# EasyEDA Pro project ProPrj_交通灯.epro

# Schematic Schematic2
Board Name: Board2; Create Date: 2024-10-21; Page Name: P1; Project Name: 交通灯-sell; Schematic Name: Schematic2; Update Date: 2024-10-21; Company: 嘉立创EDA; Page Size: A4; Version: V1.0
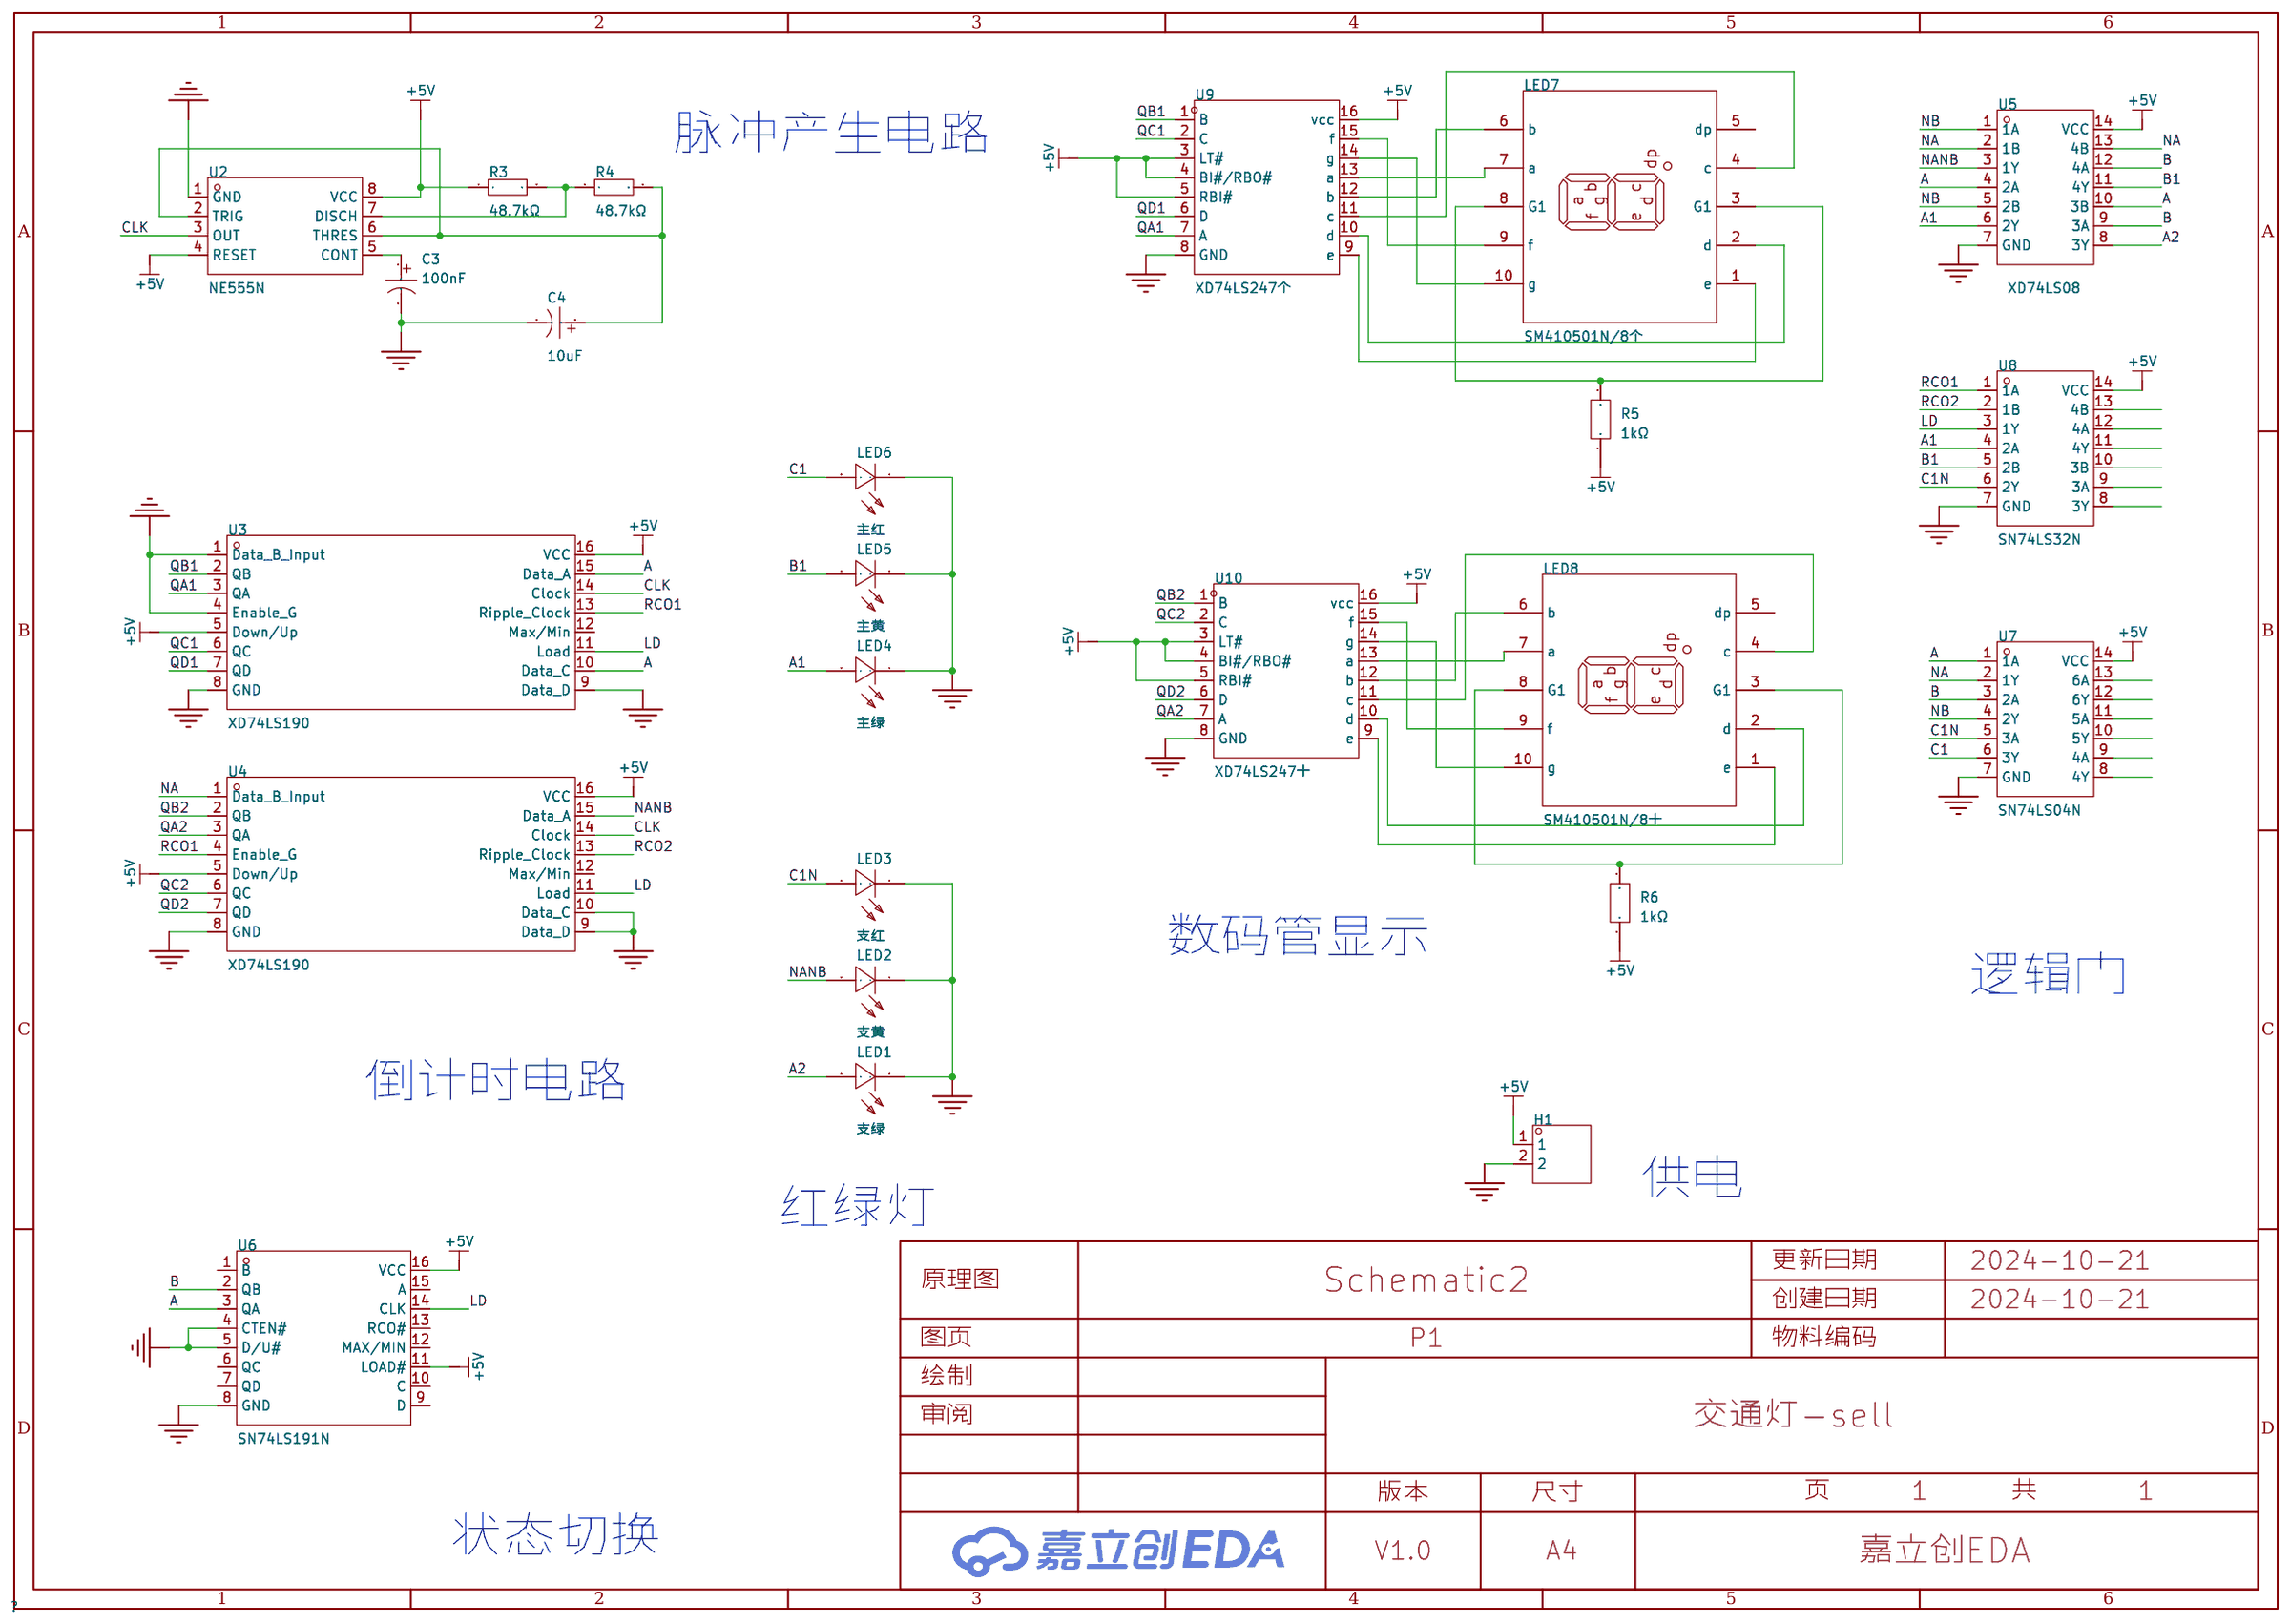
[diagram p0: schematic sheet]

## Parts
C3  100nF  [CAP-TH_BD4.0-P1.50-D0.8-FD]
C4  10uF  [CAP-TH_BD5.0-P2.00-D0.8-FD]
H1  -  [HDR-TH_2P-P2.54-V-M-1]
LED1  支绿  [LED-TH_BD3.9-P2.54-RD]
LED2  支黄  [LED-TH_BD3.9-P2.54-RD]
LED3  支红  [LED-TH_BD3.9-P2.54-RD]
LED4  主绿  [LED-TH_BD3.9-P2.54-RD]
LED5  主黄  [LED-TH_BD3.9-P2.54-RD]
LED6  主红  [LED-TH_BD3.9-P2.54-RD]
LED7  SM410501N/8个  [LED-SEG-TH_10P-L12.7-W19.0-P2.54-S15.24-BL]
LED8  SM410501N/8十  [LED-SEG-TH_10P-L12.7-W19.0-P2.54-S15.24-BL]
R3  48.7kΩ  [RES-TH_BD2.4-L6.3-P10.30-D0.6]
R4  48.7kΩ  [RES-TH_BD2.4-L6.3-P10.30-D0.6]
R5  1kΩ  [RES-TH_BD2.3-L6.5-P10.50-D0.5]
R6  1kΩ  [RES-TH_BD2.3-L6.5-P10.50-D0.5]
U2  NE555N  [DIP-8_L9.8-W6.6-P2.54-LS7.6-BL]
U3  XD74LS190  [DIP-16_L20.0-W6.4-P2.54-LS7.6-BL]
U4  XD74LS190  [DIP-16_L20.0-W6.4-P2.54-LS7.6-BL]
U5  XD74LS08  [DIP-14_L19.4-W6.4-P2.54-LS7.6-BL]
U6  SN74LS191N  [PDIP-16_L19.3-W6.4-P2.54-LS7.94-BL]
U7  SN74LS04N  [DIP-14_L19.1-W6.4-P2.54-LS7.6-BL]
U8  SN74LS32N  [DIP-14_L19.1-W6.4-P2.54-LS7.6-BL]
U9  XD74LS247个  [DIP-16_L19.3-W6.4-P2.54-LS7.6-BL]
U10  XD74LS247十  [DIP-16_L19.3-W6.4-P2.54-LS7.6-BL]

## Library data of the parts
C3 = KS104M050C07RR0VH2FP0: 容值:100nF;精度:±20%;额定电压:50V;纹波电流:1A@100kHz;等效串联电阻:-;; LCSC Part Name: 100nF ±20% 50V; Supplier Part: C45664; Manufacturer: CX(承兴); Supplier Footprint: 插件,D4xL7mm; JLCPCB Part Class: 扩展库; Datasheet: https://atta.szlcsc.com/upload/public/pdf/source/20211027/7B10195EF01EB9374BE8935690E3D906.pdf; Supplier: LCSC; Tolerance: ±20%; Rated Voltage: 50V; Ripple Current: 1A@100kHz; Lead Spacing: 1.5mm; φD: 4mm; L: 7mm; Lifetime @ Temp: 1000hrs@105℃; Operating Temperature: -40℃~+105℃
C4 = ERS1HM100D11OT: 容值:10uF;精度:±20%;额定电压:50V;; LCSC Part Name: 10uF ±20% 50V; Supplier Part: C106654; Manufacturer: AISHI(艾华集团); Supplier Footprint: 插件,D5xL11mm; JLCPCB Part Class: 扩展库; Datasheet: https://atta.szlcsc.com/upload/public/pdf/source/20191015/C438940_4B8E60A742BB0AE40DDEF87A5C89089D.pdf; Supplier: LCSC; Tolerance: ±20%; Rated Voltage: 50V; Lead Spacing: 2mm; φD: 5mm; L: 11mm; Lifetime @ Temp: 5000hrs@105℃
H1 = HDR-M_2.54_1x2P: Supplier Part: C124375; Supplier Footprint: 插件
LED1-LED6 = 204-10SUGD/S400-A4-L: Supplier Part: C778892; Manufacturer: EVERLIGHT(亿光); Supplier Footprint: 插件; JLCPCB Part Class: 扩展库; Supplier: LCSC
LED7 LED8 = SM410501N/8: 数码管位数:1位;发光颜色:红色;LED极性:共阳极;数字/字母大小(英寸):0.5;; LCSC Part Name: 1位0.5英寸红色数码管 共阳极; Supplier Part: C252200; Manufacturer: ARKLED(方舟); Supplier Footprint: 插件; JLCPCB Part Class: 扩展库; Datasheet: https://atta.szlcsc.com/upload/public/pdf/source/20180821/C252200_94AC65E7CE87F7CEF0892A0B7A50B302.pdf; Supplier: LCSC; Number of Characters: 1位; Luminous Color: 红色; LED Polarity: 共阳极; Digit/Alpha Size(inch): 0.5
R3 R4 = MFR-25FBF52-48K7: 电阻类型:金属膜电阻;阻值:48.7kΩ;精度:±1%;功率:250mW;温度系数:±100ppm/℃;; LCSC Part Name: 金属膜电阻 48.7kΩ ±1% 250mW; Supplier Part: C1365709; Manufacturer: YAGEO(国巨); Supplier Footprint: 插件,D2.4xL6.3mm; JLCPCB Part Class: 扩展库; Datasheet: https://atta.szlcsc.com/upload/public/pdf/source/20201029/C911418_CEA09B7112BCFF5AE38F343DDB8D42E7.pdf; Supplier: LCSC; Type: 金属膜电阻; Tolerance: ±1%; Power(Watts): 250mW; Temperature Coefficient: ±100ppm/℃; Operating Temperature Range: -55℃~+155℃
R5 R6 = MF1/4W-1KΩ±1%T52: 电阻类型:金属膜电阻;阻值:1kΩ;精度:±1%;功率:250mW;温度系数:±200ppm/℃;; LCSC Part Name: 金属膜电阻 1kΩ ±1% 250mW; Supplier Part: C713997; Manufacturer: 华星机电; Supplier Footprint: 插件,D2.3xL6.5mm; JLCPCB Part Class: 扩展库; Datasheet: https://atta.szlcsc.com/upload/public/pdf/source/20200731/C713882_AE8EB1102749D7E4FB4FB13DC898C429.pdf; Supplier: LCSC; Type: 金属膜电阻; Tolerance: ±1%; Power(Watts): 250mW; Temperature Coefficient: ±200ppm/℃
U2 = NE555N_C398063: LCSC Part Name: 时基集成芯片; Supplier Part: C398063; Manufacturer: HGSEMI(华冠); Supplier Footprint: DIP-8; JLCPCB Part Class: 扩展库; Datasheet: https://atta.szlcsc.com/upload/public/pdf/source/20210507/C398063_2BAEB56D23EF029756B1D4DE6D68B235.pdf; Supplier: LCSC
U3 U4 = XD74LS190: LCSC Part Name: 计数器 IC; Supplier Part: C707104; Manufacturer: XINLUDA(信路达); Supplier Footprint: DIP-16; JLCPCB Part Class: 扩展库; Datasheet: https://atta.szlcsc.com/upload/public/pdf/source/20200724/C707104_542995D84A96E0879D87E5CA2CD6E235.pdf; Supplier: LCSC
U5 = XD74LS08: 逻辑类型:-;; Supplier Part: C521139; Manufacturer: XINLUDA(信路达); Supplier Footprint: DIP-14; JLCPCB Part Class: 扩展库; Datasheet: https://atta.szlcsc.com/upload/public/pdf/source/20200619/C521139_1A49B54134F5C67771B06657CA6D9AAF.pdf; Supplier: LCSC
U6 = SN74LS191N: 工作电压:4.75V~5.25V;元件数:1;触发沿:上升沿;计数速率:25MHz;; LCSC Part Name: 25MHz 4位二进制计数器; Supplier Part: C1523316; Manufacturer: TI(德州仪器); Supplier Footprint: PDIP-16; JLCPCB Part Class: 扩展库; Datasheet: https://www.ti.com/cn/lit/gpn/sn54ls191; Supplier: LCSC; Logic Type: 二进制计数器; Direction: 向上计数器；向下计数器; Supply Voltage: 4.75V~5.25V; Number of Elements: 1; Trigger Type: 上升沿; Timing mode: 同步; Count Rate: 25MHz; Operating Temperature: 0℃~+70℃
U7 = SN74LS04N(LX): 电源电压:2V~6V;供电电流(最大值):2uA;电路数:6;最大传播延迟(tpd):14ns@6V;; Supplier Part: C22374093; Manufacturer: LX(灵星芯微); Supplier Footprint: DIP-14; JLCPCB Part Class: 扩展库; Datasheet: https://atta.szlcsc.com/upload/public/pdf/source/20240402/834FB3A59B1B710673385084ADD2A13F.pdf; Supplier: LCSC; Supply Voltage(Single): 2V~6V; Supply Current (Max): 2uA; Number of Circuits: 6; Sink Current: 5.2mA; Source Current: 5.2mA; High level range (VIH): 1.5V~4.2V; Low level range (VIL): 500mV~1.8V; High level range (VOH): 1.9V~5.9V; Low level range (VOL): 100mV~260mV; Max Propagation Delay: 14ns@6V; Series: 74LS系列; Operating Temperature: -40℃~+125℃
U8 = SN74LS32N_C22466295: Supplier Part: C22466295; Manufacturer: LX(灵星芯微); Supplier Footprint: DIP-14; JLCPCB Part Class: 扩展库; Datasheet: https://atta.szlcsc.com/upload/public/pdf/source/20240614/E0F0D1A0EAE2126389B0ECE8583863BF.pdf; Supplier: LCSC
U9 U10 = XD74LS247: BCD 到 7 段解码器/驱动器; Supplier Part: C609771; Manufacturer: XINLUDA(信路达); Supplier Footprint: DIP-16; JLCPCB Part Class: 扩展库; Datasheet: https://atta.szlcsc.com/upload/public/pdf/source/20200619/C609772_90A4531F9A683613D8102D7E5440D56B.pdf; Supplier: LCSC

## Nets
+5V: H1.1 R3.1 R5.1 R6.1 U2.4(RESET) U2.8(VCC) U3.5(Down/Up) U3.16(VCC) U4.5(Down/Up) U4.16(VCC) U5.14(VCC) U6.11(LOAD#) U6.16(VCC) U7.14(VCC) U8.14(VCC) U9.3(LT#) U9.4(BI#/RBO#) U9.5(RBI#) U9.16(vcc) U10.3(LT#) U10.4(BI#/RBO#) U10.5(RBI#) U10.16(vcc)
GND: C3.2 C4.2 H1.2 LED1.1(-) LED2.1(-) LED3.1(-) LED4.1(-) LED5.1(-) LED6.1(-) U2.1(GND) U3.1(Data B Input) U3.4(Enable G) U3.8(GND) U3.9(Data D) U4.8(GND) U4.9(Data D) U4.10(Data C) U5.7(GND) U6.4(CTEN#) U6.5(D/U#) U6.8(GND) U7.7(GND) U8.7(GND) U9.8(GND) U10.8(GND)
A: U3.10(Data C) U3.15(Data A) U5.4(2A) U5.10(3B) U6.3(QA) U7.1(1A)
A1: LED4.2(+) U5.6(2Y) U8.4(2A)
A2: LED1.2(+) U5.8(3Y)
B: U5.9(3A) U5.12(4A) U6.2(QB) U7.3(2A)
B1: LED5.2(+) U5.11(4Y) U8.5(2B)
C1: LED6.2(+) U7.6(3Y)
C1N: LED3.2(+) U7.5(3A) U8.6(2Y)
CLK: U2.3(OUT) U3.14(Clock) U4.14(Clock)
LD: U3.11(Load) U4.11(Load) U6.14(CLK) U8.3(1Y)
NA: U4.1(Data B Input) U5.2(1B) U5.13(4B) U7.2(1Y)
NANB: LED2.2(+) U4.15(Data A) U5.3(1Y)
NB: U5.1(1A) U5.5(2B) U7.4(2Y)
QA1: U3.3(QA) U9.7(A)
QA2: U4.3(QA) U10.7(A)
QB1: U3.2(QB) U9.1(B)
QB2: U4.2(QB) U10.1(B)
QC1: U3.6(QC) U9.2(C)
QC2: U4.6(QC) U10.2(C)
QD1: U3.7(QD) U9.6(D)
QD2: U4.7(QD) U10.6(D)
RCO1: U3.13(Ripple Clock) U4.4(Enable G) U8.1(1A)
RCO2: U4.13(Ripple Clock) U8.2(1B)
$1N252: C4.1 R4.2 U2.2(TRIG) U2.6(THRES)
$1N730: R3.2 R4.1 U2.7(DISCH)
$1N740: C3.1 U2.5(CONT)
$1N6367: LED7.7(a) U9.13(a)
$1N6372: LED7.6(b) U9.12(b)
$1N6378: LED7.10(g) U9.14(g)
$1N6385: LED7.9(f) U9.15(f)
$1N6412: LED7.3(G1) LED7.8(G1) R5.2
$1N6533: LED7.4(c) U9.11(c)
$1N6544: LED7.1(e) U9.9(e)
$1N6553: LED7.2(d) U9.10(d)
$1N6791: LED8.7(a) U10.13(a)
$1N6794: LED8.6(b) U10.12(b)
$1N6798: LED8.10(g) U10.14(g)
$1N6802: LED8.9(f) U10.15(f)
$1N6806: LED8.3(G1) LED8.8(G1) R6.2
$1N6815: LED8.4(c) U10.11(c)
$1N6821: LED8.1(e) U10.9(e)
$1N6825: LED8.2(d) U10.10(d)

Not connected (* = marked no-connect by the designer): LED7 5(dp); LED8 5(dp); U3 12(Max/Min); U4 12(Max/Min); U6 1(B) 6(QC) 7(QD) 9(D) 10(C) 12(MAX/MIN) 13(RCO#) 15(A); U7 8(4Y) 9(4A) 10(5Y) 11(5A) 12(6Y) 13(6A); U8 8(3Y) 9(3A) 10(3B) 11(4Y) 12(4A) 13(4B)

## Notes on the sheet
- 脉冲产生电路
- 数码管显示
- 逻辑门
- 倒计时电路
- 供电
- 红绿灯
- 状态切换

# Board PCB3
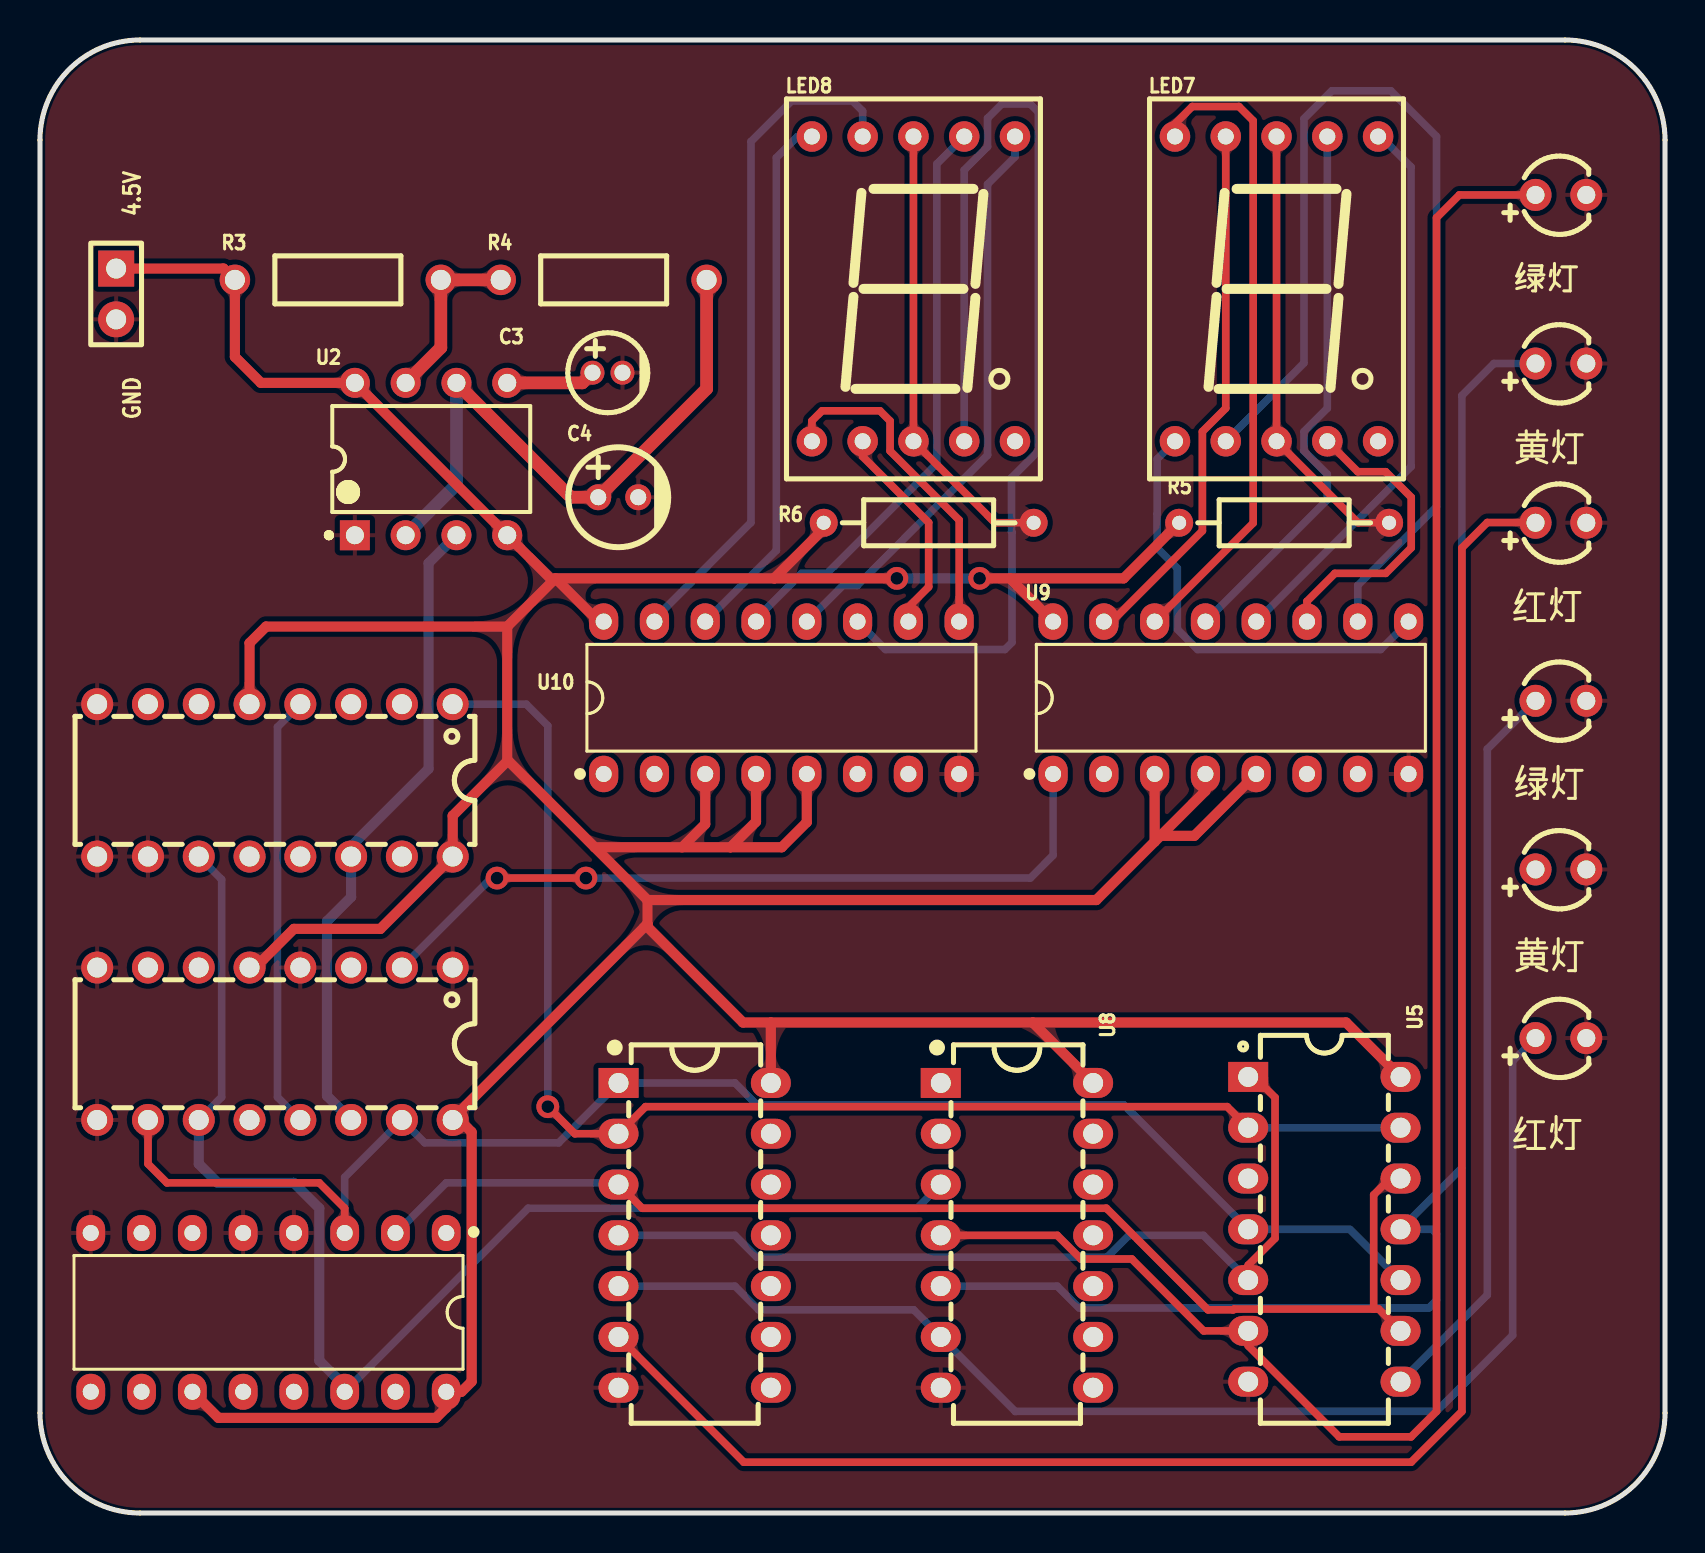
[diagram p1: board, top side]
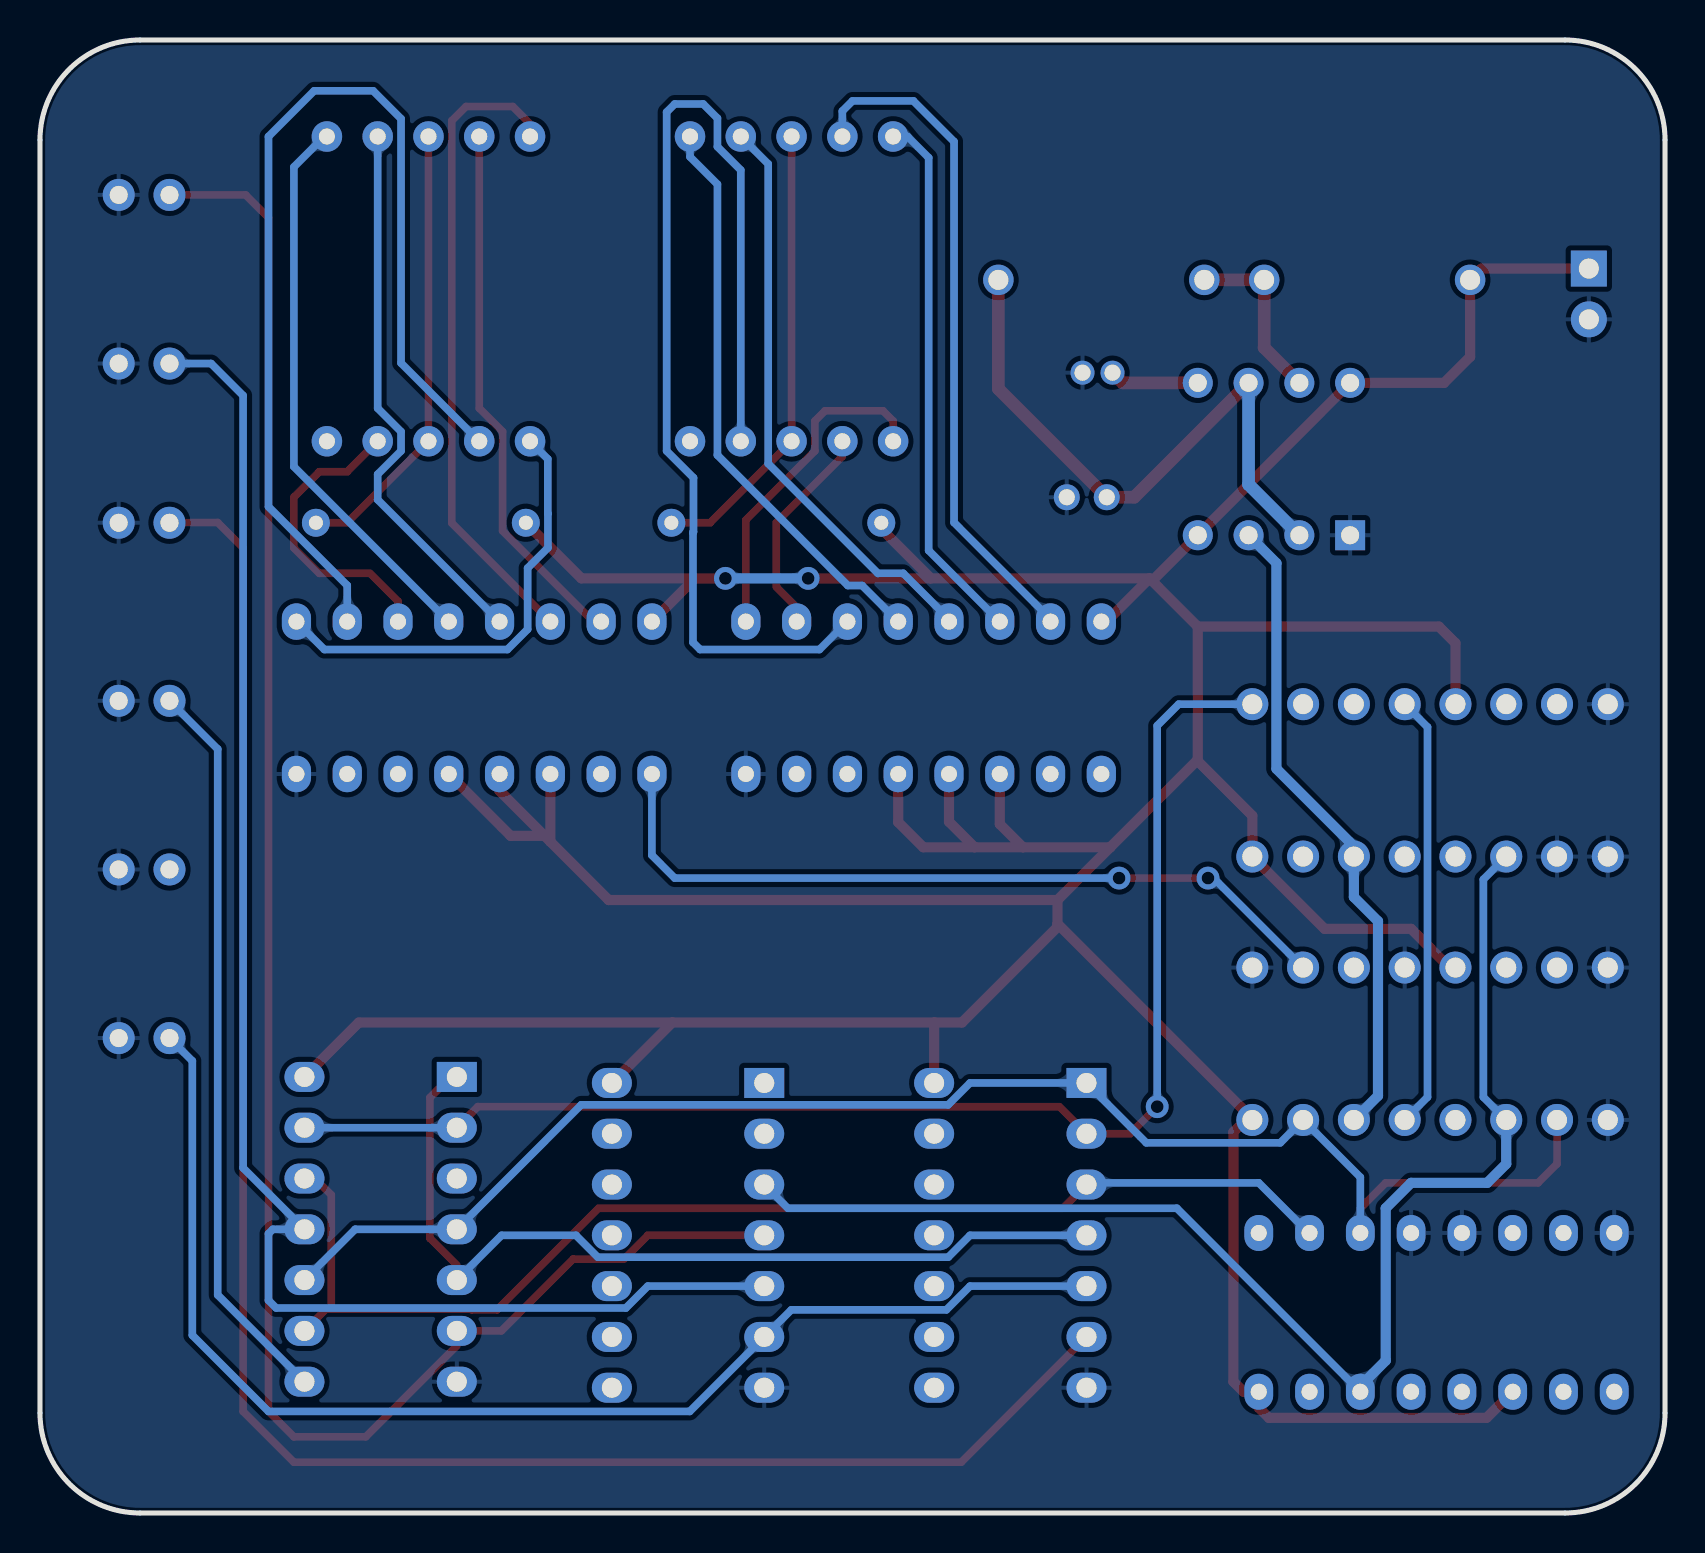
[diagram p2: board, bottom side, seen from below]

Outline 81.28 x 73.66 mm; copper layers: Top Layer, Inner1, Inner2, Bottom Layer. Coordinates in mm from the lower left corner of the outline.
Outline path: 0,68.66 0,5 arc(1.46,1.46) 5,0 76.28,0 arc(79.82,1.46) 81.28,5 81.28,68.66 arc(79.82,72.2) 76.28,73.66 5,73.66 arc(1.46,72.2) 0,68.66
Stack: Top Layer 0.035mm 外层铜厚1oz / Dielectric1 0.2104mm 7628 RC49% 8.6mil / Inner1 0.0152mm 内层铜厚 / Dielectric2 1.065mm 1.1mm H/HOZ Copper / Inner2 0.0152mm 内层铜厚 / Dielectric3 0.2104mm 7628 RC49% 8.6mil / Bottom Layer 0.035mm 外层铜厚1oz

## Design rules (mm)
template: JLCPCB Capability(Two Layers Board)
spacing copperThickness1oz (default): track to track 0.102, other pairs 0.152 to 0.3
spacing copperThickness2oz: track to track 0.203, other pairs 0.152 to 0.3
track width copperThickness1oz (default): min 0.127, default 0.254, max 2.54
track width copperThickness2oz: min 0.203, default 0.254, max 2.54
differential pair differentialPair (default): width min 0.127, default 0.254, max 2.54; gap min 0.152, default 0.152
via viaSize (default): diameter min 0.5, default 0.61, max 10; hole min 0.3, default 0.305, max 6.3

## Placement (name value [footprint] x y rotation side)
4.7V  -  [HDR-TH_2P-P2.54-V-M-1]  3.81 60.96 270 top
C3  100nF  [CAP-TH_BD4.0-P1.50-D0.8-FD]  28.38 57.02 0 top
C4  10uF  [CAP-TH_BD5.0-P2.00-D0.8-FD]  28.92 50.8 0 top
LED1  支绿  [LED-TH_BD3.9-P2.54-RD]  76.07 40.61 180 top
LED2  支黄  [LED-TH_BD3.9-P2.54-RD]  76.07 32.18 180 top
LED3  支红  [LED-TH_BD3.9-P2.54-RD]  76.07 23.75 180 top
LED5  主黄  [LED-TH_BD3.9-P2.54-RD]  76.07 57.48 180 top
LED6  主红  [LED-TH_BD3.9-P2.54-RD]  76.07 49.52 180 top
LED7  SM410501N/8个  [LED-SEG-TH_10P-L12.7-W19.0-P2.54-S15.24-BL]  61.85 61.21 0 top
LED8  SM410501N/8十  [LED-SEG-TH_10P-L12.7-W19.0-P2.54-S15.24-BL]  43.69 61.21 0 top
R3  48.7kΩ  [RES-TH_BD2.4-L6.3-P10.30-D0.6]  14.9 61.67 0 top
R4  48.7kΩ  [RES-TH_BD2.4-L6.3-P10.30-D0.6]  28.19 61.67 0 top
R5  1kΩ  [RES-TH_BD2.3-L6.5-P10.50-D0.5]  62.23 49.52 0 top
R6  1kΩ  [RES-TH_BD2.3-L6.5-P10.50-D0.5]  44.45 49.52 0 top
U2  NE555N  [DIP-8_L9.8-W6.6-P2.54-LS7.6-BL]  19.56 52.71 0 top
U3  XD74LS190  [DIP-16_L20.0-W6.4-P2.54-LS7.6-BL]  11.75 23.47 180 top
U4  XD74LS190  [DIP-16_L20.0-W6.4-P2.54-LS7.6-BL]  11.75 36.64 180 top
U5  XD74LS08  [DIP-14_L19.4-W6.4-P2.54-LS7.6-BL]  64.24 14.19 270 top
U6  SN74LS191N  [PDIP-16_L19.3-W6.4-P2.54-LS7.94-BL]  11.43 10.03 180 top
U7  SN74LS04N  [DIP-14_L19.1-W6.4-P2.54-LS7.6-BL]  32.75 13.89 270 top
U8  SN74LS32N  [DIP-14_L19.1-W6.4-P2.54-LS7.6-BL]  48.87 13.89 270 top
U9  XD74LS247个  [DIP-16_L19.3-W6.4-P2.54-LS7.6-BL]  59.56 40.77 0 top
U10  XD74LS247十  [DIP-16_L19.3-W6.4-P2.54-LS7.6-BL]  37.08 40.77 0 top
绿灯  主绿  [LED-TH_BD3.9-P2.54-RD]  76.07 65.91 180 top

## Footprints (pads in the part's own frame, mm; a bottom-side part is the same pattern mirrored in y, then rotated)
CAP-TH_BD4.0-P1.50-D0.8-FD
  round 1.2 hole 0.8: 1(-0.75,0) 2(0.75,0)
CAP-TH_BD5.0-P2.00-D0.8-FD
  round 1.3 hole 0.8: 1(-1,0) 2(1,0)
DIP-8_L9.8-W6.6-P2.54-LS7.6-BL
  rect 1.5x1.5 hole 0.9: 1(-3.81,-3.81)
  round 1.5 hole 0.9: 2(-1.27,-3.81) 3(1.27,-3.81) 4(3.81,-3.81) 5(3.81,3.81) 6(1.27,3.81) 7(-1.27,3.81) 8(-3.81,3.81)
DIP-14_L19.1-W6.4-P2.54-LS7.6-BL
  rect 1.5x2 hole 1: 1(-7.62,-3.81)
  oval 1.5x2 hole 1: 2(-5.08,-3.81) 3(-2.54,-3.81) 4(0,-3.81) 5(2.54,-3.81) 6(5.08,-3.81) 7(7.62,-3.81) 8(7.62,3.81) 9(5.08,3.81) 10(2.54,3.81) 11(0,3.81) 12(-2.54,3.81) 13(-5.08,3.81) 14(-7.62,3.81)
DIP-14_L19.4-W6.4-P2.54-LS7.6-BL
  rect 1.5x2 hole 1: 1(-7.62,-3.811)
  oval 1.5x2 hole 1: 2(-5.08,-3.811) 3(-2.54,-3.811) 4(0,-3.811) 5(2.54,-3.811) 6(5.08,-3.811) 7(7.62,-3.811) 8(7.62,3.811) 9(5.08,3.809) 10(2.54,3.809) 11(0,3.809) 12(-2.54,3.809) 13(-5.08,3.809) 14(-7.62,3.809)
DIP-16_L19.3-W6.4-P2.54-LS7.6-BL
  oval 1.46x1.825 hole 0.8: 1(-8.89,-3.81) 2(-6.35,-3.81) 3(-3.81,-3.81) 4(-1.27,-3.81) 5(1.27,-3.81) 6(3.81,-3.81) 7(6.35,-3.81) 8(8.89,-3.81) 9(8.89,3.81) 10(6.35,3.81) 11(3.81,3.81) 12(1.27,3.81) 13(-1.27,3.81) 14(-3.81,3.81) 15(-6.35,3.81) 16(-8.89,3.81)
DIP-16_L20.0-W6.4-P2.54-LS7.6-BL
  round 1.6 hole 1: 1(-8.89,-3.81) 2(-6.35,-3.81) 3(-3.81,-3.81) 4(-1.27,-3.81) 5(1.27,-3.81) 6(3.81,-3.81) 7(6.35,-3.81) 8(8.89,-3.81) 9(8.89,3.81) 10(6.35,3.81) 11(3.81,3.81) 12(1.27,3.81) 13(-1.27,3.81) 14(-3.81,3.81) 15(-6.35,3.81) 16(-8.89,3.81)
HDR-TH_2P-P2.54-V-M-1
  rect 1.8x1.8 hole 1: 1(-1.27,0)
  round 1.8 hole 1: 2(1.27,0)
LED-SEG-TH_10P-L12.7-W19.0-P2.54-S15.24-BL
  round 1.524 hole 0.8: 1(-5.08,-7.62) 2(-2.54,-7.62) 3(0,-7.62) 4(2.54,-7.62) 5(5.08,-7.62) 6(5.08,7.62) 7(2.54,7.62) 8(0,7.62) 9(-2.54,7.62) 10(-5.08,7.62)
LED-TH_BD3.9-P2.54-RD
  round 1.6 hole 0.9: 1(-1.27,0) 2(1.27,0)
PDIP-16_L19.3-W6.4-P2.54-LS7.94-BL
  oval 1.44x1.8 hole 0.8: 1(-8.89,-3.97) 2(-6.35,-3.97) 3(-3.81,-3.97) 4(-1.27,-3.97) 5(1.27,-3.97) 6(3.81,-3.97) 7(6.35,-3.97) 8(8.89,-3.97) 9(8.89,3.97) 10(6.35,3.97) 11(3.81,3.97) 12(1.27,3.97) 13(-1.27,3.97) 14(-3.81,3.97) 15(-6.35,3.97) 16(-8.89,3.97)
RES-TH_BD2.3-L6.5-P10.50-D0.5
  round 1.4 hole 0.7: 1(-5.25,0) 2(5.25,0)
RES-TH_BD2.4-L6.3-P10.30-D0.6
  round 1.524 hole 1: 1(-5.15,0) 2(5.15,0)

## Nets
As in the schematic, except:
+5V: 4.7V.1 R3.1 R5.1 R6.1 U2.4 U2.8 U3.5 U3.16 U4.5 U4.16 U5.14 U6.11 U6.16 U7.14 U8.14 U9.3 U9.4 U9.5 U9.16 U10.3 U10.4 U10.5 U10.16
GND: 4.7V.2 C3.2 C4.2 LED1.1 LED2.1 LED3.1 LED5.1 LED6.1 U2.1 U3.1 U3.4 U3.8 U3.9 U4.8 U4.9 U4.10 U5.7 U6.4 U6.5 U6.8 U7.7 U8.7 U9.8 U10.8 绿灯.1
A1: U5.6 U8.4 绿灯.2

Pads without a net: LED7 5; LED8 5; U3 12; U4 12; U6 1 6 7 9 10 12 13 15

## Via types
v1: diameter 1.143, hole 0.635, Top Layer to Bottom Layer, 5 vias

## Routing (per net, layer and track width the routed paths; a pad name or vN(x,y) marks a point on that pad's centre or on a via; arc(x,y) is an arc through that point)
+5V: length 282.8
  Top Layer w0.508: 25.65,46.61 U2.4 U2.8 11.05,56.52 9.75,57.82 R3.1 9.18,62.23 4.7V.1 ; 25.65,46.61 25.78,46.74 ; 25.65,46.61 23.37,44.33 ; 55.75,33.57 56.05,33.86 ; 55.75,33.57 52.83,30.65 30.39,30.65 ; 55.75,33.57 U9.3 ; 56.05,33.86 57.74,33.86 U9.5 ; 56.05,33.86 58.29,36.11 U9.4 ; 25.78,46.74 27.94,44.58 U10.16 ; 25.78,46.74 36.72,46.74 ; 30.39,29.46 20.64,19.72 U3.16 20.98,19.66 21.59,19.05 21.59,6.57 21.08,6.06 U6.16 20.32,5.27 19.81,4.76 8.93,4.76 U6.11 ; 30.39,29.46 30.39,30.65 ; 30.39,29.46 30.39,29.31 35.16,24.53 36.56,24.53 ; U9.16 48.51,46.74 ; 48.51,46.74 54.2,46.74 R5.1 ; 48.51,46.74 v1(47,46.74) ; 23.37,44.33 11.31,44.33 10.48,43.5 U4.5 ; 23.37,44.33 23.37,37.6 ; v1(42.86,46.74) 36.72,46.74 ; 36.72,46.74 39.2,49.22 R6.1 ; 30.39,30.65 27.75,33.29 ; 23.37,37.6 20.64,34.87 U4.16 17.03,29.21 12.7,29.21 10.77,27.28 U3.5 ; 23.37,37.6 23.44,37.6 27.75,33.29 ; 36.56,24.53 36.56,21.51 ; 36.56,24.53 49.65,24.53 ; 34.54,33.29 37.1,33.29 38.35,34.54 U10.5 ; 34.54,33.29 35.81,34.57 U10.4 ; 34.54,33.29 32.11,33.29 ; 49.65,24.53 52.68,21.51 ; 49.65,24.53 65.33,24.53 U5.14 ; 27.75,33.29 32.11,33.29 ; 32.11,33.29 33.27,34.45 U10.3
  Bottom Layer w0.508: v1(42.86,46.74) v1(47,46.74)
A: length 76.8
  Top Layer w0.381: U6.3 15.24,15.24 13.97,16.51 6.35,16.51 5.4,17.46 U3.10
  Bottom Layer w0.381: U5.10 65.51,14.19 U5.4 54.21,20.41 35.85,20.41 34.76,21.51 28.94,21.51 25.94,18.51 19.24,18.51 U3.15 15.24,16.79 U6.3
A1: length 95
  Top Layer w0.381: 绿灯.2 70.99,65.91 69.85,64.77 69.85,5.08 68.58,3.81 64.98,3.81 60.43,8.36 U5.6 58.2,9.11 54.61,12.7 52.07,12.7 50.88,13.89 U8.4
A2: length 36.8
  Bottom Layer w0.381: U5.8 72.39,10.9 72.39,38.2 LED1.2
B: length 61.8
  Top Layer w0.381: U5.9 66.96,10.2 66.71,10.2 ; 28.94,16.43 30.12,15.24 53.34,15.24 58.42,10.16 59.69,10.16 59.73,10.2 66.71,10.2 ; 66.71,10.2 66.71,15.91 67.53,16.73 U5.12
  Bottom Layer w0.381: 28.94,16.43 28.85,16.51 20.32,16.51 17.81,14 U6.2
B1: length 77.9
  Bottom Layer w0.381: 45.06,11.34 50.88,11.34 51.97,10.25 69.47,10.25 69.85,10.63 69.85,13.97 69.63,14.19 U5.11 71.12,17.26 71.12,55.88 72.72,57.48 LED5.2
C1: length 93.7
  Top Layer w0.381: U7.6 35.2,2.54 68.58,2.54 71.12,5.08 71.12,48.26 72.39,49.53 74.79,49.53 LED6.2 74.8,49.05
C1N: length 64.2
  Bottom Layer w0.381: LED3.2 73.66,22.61 73.66,8.89 69.85,5.08 48.78,5.08 U8.6 43.7,10.16 35.95,10.16 34.76,11.34 28.94,11.34
CLK: length 32.4
  Bottom Layer w0.508: U3.14 14.36,20.86 14.36,29.6 15.56,30.8 U4.14 15.56,33.34 19.44,37.22 19.44,47.5 U2.3
LD: length 67.1
  Bottom Layer w0.381: U4.11 9.08,31.68 9.08,20.8 U3.11 ; U6.14 24.42,15.24 43.87,15.24 45.06,16.43
  Bottom Layer w0.508: U3.11 7.94,17.46 8.89,16.51 12.7,16.51 13.97,15.24 13.97,7.62 15.24,6.35 U6.14
NA: length 68.5
  Top Layer w0.381: v1(25.4,20.32) 26.75,18.97 28.94,18.97 30.29,20.32 59.38,20.32 U5.2
  Bottom Layer w0.381: v1(25.4,20.32) 25.4,39.37 24.32,40.45 U4.1 ; U5.13 U5.2
NANB: length 78.4
  Inner1 w0.381: LED2.2 74.8,30.35 61.18,16.73 U5.3 58.2,16.73 57.15,17.78 57.15,29.21 55.88,30.48 19.05,30.48 18.1,31.43 U4.15
NB: length 44.8
  Top Layer w0.381: U5.5 60.43,12.39 61.77,13.73 61.77,20.78 60.74,21.81 U5.1
  Bottom Layer w0.381: U5.5 58.19,13.89 54.47,13.89 53.38,12.79 35.85,12.79 34.76,13.89 U7.4
QA1: length 61
  Inner2 w0.381: U3.3 15.56,28.26 16.51,29.21 58.42,29.21 59.37,30.16 59.37,37.89 59.69,38.21 65.53,38.21 65.91,37.83 U9.7
QA2: length 34.6
  Inner1 w0.381: U4.3 15.56,35.24 16.51,34.29 40.77,34.29 U10.7
QB1: length 39
  Top Layer w0.381: v1(22.86,31.75) v1(27.31,31.75)
  Bottom Layer w0.381: U3.2 22.58,31.75 v1(22.86,31.75) ; U9.1 50.67,32.89 49.53,31.75 v1(27.31,31.75)
QB2: length 12.4
  Inner1 w0.381: U4.2 18.1,39.05 19.05,38.1 27.05,38.1 U10.1
QC1: length 53.7
  Inner2 w0.381: U3.6 7.94,29.53 8.89,30.48 52.07,30.48 53.21,31.62 U9.2
QC2: length 27.8
  Inner1 w0.381: U10.2 30.73,40.39 29.21,41.91 8.89,41.91 7.94,40.96 U4.6
QD1: length 69.6
  Inner2 w0.381: U9.6 63.37,26.54 62.23,25.4 7.28,25.4 U3.7
QD2: length 42.3
  Inner1 w0.381: U4.7 5.4,42.23 6.35,43.18 38.1,43.18 40.89,40.39 U10.6
RCO1: length 56.8
  Inner1 w0.381: 45.06,21.51 43.96,22.6 13.71,22.6 13.02,21.91 U3.13
  Bottom Layer w0.381: U4.4 11.88,39.3 11.88,20.8 U3.13
RCO2: length 47.3
  Inner1 w0.381: U4.13 13.02,30.16 13.97,29.21 45.72,29.21 46.99,27.94 46.99,20.9 45.06,18.97
$1N252: length 31.2
  Top Layer w0.635: R4.2 33.34,56.22 C4.1 26.55,50.8 U2.6
  Bottom Layer w0.635: U2.6 20.83,51.44 U2.2
$1N730: length 8.9
  Top Layer w0.635: U2.7 20.05,58.27 R3.2 R4.1
$1N740: length 4.5
  Top Layer w0.635: U2.5 27.13,56.52 C3.1
$1N6367: length 27.7
  Bottom Layer w0.381: U9.13 64.39,50.67 64.39,51.94 63.22,53.11 63.22,54.08 64.39,55.25 LED7.7
$1N6372: length 28.2
  Bottom Layer w0.381: U9.12 68.58,52.32 68.58,67.31 67.06,68.83 LED7.6
$1N6378: length 32.3
  Top Layer w0.381: U9.14 60.68,49.51 60.68,69.62 59.97,70.33 57.63,70.33 56.77,69.47 LED7.10
$1N6385: length 27
  Top Layer w0.381: U9.15 53.6,44.58 58.14,49.12 58.14,54.08 59.31,55.25 LED7.9
$1N6412: length 22.6
  Top Layer w0.381: LED7.8 LED7.3 65.92,49.52 R5.2
$1N6533: length 15.2
  Top Layer w0.381: LED7.4 65.91,52.07 67.31,52.07 68.59,50.79 68.59,48.27 67.31,46.99 64.77,46.99 63.37,45.59 U9.11
$1N6544: length 22.8
  Bottom Layer w0.381: U9.9 67.06,43.18 57.9,43.18 56.89,44.19 56.89,47.25 55.87,48.27 55.87,49.98 55.88,49.98 55.88,52.71 LED7.1
$1N6553: length 51.8
  Bottom Layer w0.381: LED7.2 63.22,57.51 63.22,69.72 64.62,71.12 67.56,71.12 69.85,68.83 69.85,50.32 65.91,46.39 U9.10
$1N6791: length 29.3
  Bottom Layer w0.381: U10.13 35.81,44.7 38.1,46.99 39.37,46.99 44.86,52.48 44.86,67.46 LED8.7
$1N6794: length 29
  Bottom Layer w0.381: U10.12 40.16,46.38 40.88,46.38 47.4,52.9 47.4,66.45 48.77,67.82 LED8.6
$1N6798: length 26.9
  Bottom Layer w0.381: LED8.10 37.89,68.83 36.83,67.77 36.83,48.13 U10.14
$1N6802: length 33.9
  Bottom Layer w0.381: LED8.9 41.15,70.1 40.64,70.61 37.59,70.61 35.56,68.58 35.56,49.53 30.73,44.7 U10.15
$1N6806: length 22.9
  Top Layer w0.381: R6.2 47.76,49.52 LED8.3 LED8.8
$1N6815: length 55.2
  Bottom Layer w0.381: LED8.4 46.23,67.16 47.4,68.32 47.4,69.75 48.11,70.46 49.53,70.46 49.94,70.05 49.94,53.11 48.59,51.77 48.59,49.06 48.62,49.03 48.62,43.54 48.26,43.18 42.29,43.18 U10.11
$1N6821: length 16.8
  Top Layer w0.381: LED8.1 38.61,54.61 39.12,55.12 42.01,55.12 42.52,54.61 42.52,53.11 45.97,49.66 U10.9
$1N6825: length 10.8
  Top Layer w0.381: LED8.2 41.15,52.83 44.45,49.53 44.45,46.31 43.43,45.3 U10.10

## Copper pours and planes (outline as drawn; the poured copper is in the pictures)
GND on Top Layer: -5.08,82.55 87.63,82.55 87.63,-3.81 -5.08,-3.81
GND on Bottom Layer: -10.16,77.47 90.17,77.47 90.17,-11.43 -10.16,-11.43

Small or netless copper shapes (teardrops, artwork), in the pictures only: 89 on Top Layer, 64 on Bottom Layer, 16 on Inner1, 6 on Inner2

## Text on the board
Top Silkscreen Layer: 4.5V | GND | 红灯 | 绿灯 | 黄灯
